# EAGLE design DRV8818 (EAGLE 7.2.0)
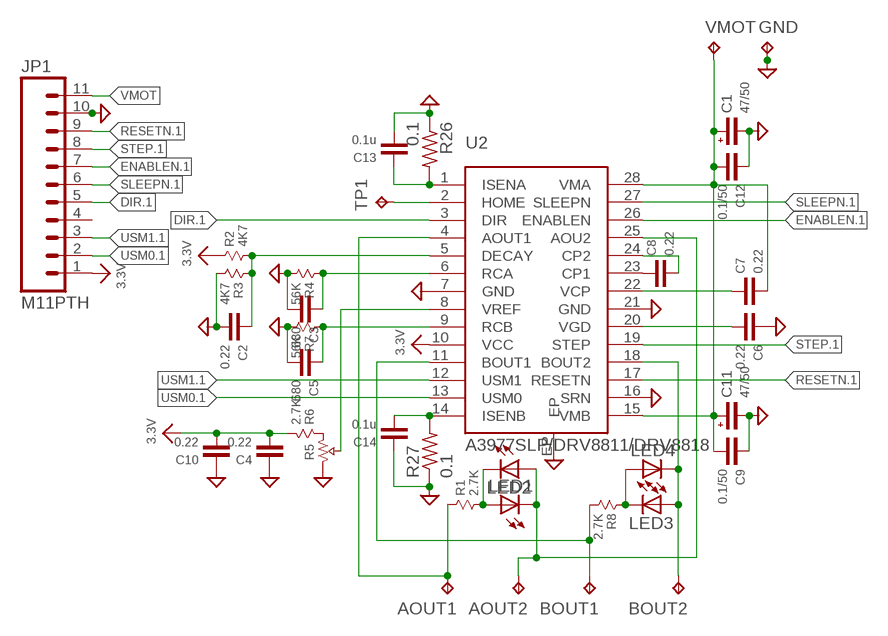
[diagram p0: schematic, sheet 1]

## Parts
AOUT1  TPTP20R  [TP20R]
AOUT2  TPTP20R  [TP20R]
BOUT1  TPTP20R  [TP20R]
BOUT2  TPTP20R  [TP20R]
C1  47/50  CAP-POL-7343  [CT7343]
C2  0.22  CAP-0603  [0603]
C3  680  CAP-0603  [0603]
C4  0.22  CAP-0603  [0603]
C5  680  CAP-0603  [0603]
C6  0.22  CAP-0603  [0603]
C7  0.22  CAP-0603  [0603]
C8  0.22  CAP-0603  [0603]
C9  0.1/50  CAP-0603  [0603]
C10  0.22  CAP-0603  [0603]
C11  47/50  CAP-POL-7343  [CT7343]
C12  0.1/50  CAP-0603  [0603]
C13  0.1u  CAP-0603  [0603]
C14  0.1u  CAP-0603  [0603]
GND  TPTP20R  [TP20R]
JP1  M11PTH  [1X11]
LED1  LEDCHIP-LED0603  [CHIP-LED0603]
LED2  LEDCHIP-LED0603  [CHIP-LED0603]
LED3  LEDCHIP-LED0603  [CHIP-LED0603]
LED4  LEDCHIP-LED0603  [CHIP-LED0603]
R1  2.7K  RESISTOR-0603  [0603]
R2  4K7  RESISTOR-0603  [0603]
R3  4K7  RESISTOR-0603  [0603]
R4  56K  RESISTOR-0603  [0603]
R5  PVZ3A  [PVZ3A]
R6  2.7K  RESISTOR-0603  [0603]
R7  56K  RESISTOR-0603  [0603]
R8  2.7K  RESISTOR-0603  [0603]
R26  0.1  R-US_R2512  [R2512]
R27  0.1  R-US_R2512  [R2512]
TP1  TPTP08R  [TP08R]
U2  A3977SLP/DRV8811/DRV8818  DRV8811  [SSOP28EP]
VMOT  TPTP20R  [TP20R]

## Nets
3.3V: C4.1 C10.1 JP1.1 R2.1 R6.2 U2.10(VCC)
AOUT1: AOUT1.TP R1.1 U2.4(AOUT1)
AOUT2: AOUT2.TP LED1.C LED2.A U2.25(AOU2)
BOUT1: BOUT1.TP R8.2 U2.11(BOUT1)
BOUT2: BOUT2.TP LED3.A LED4.C U2.18(BOUT2)
DIR.1: JP1.5 U2.3(DIR)
ENABLEN.1: JP1.7 U2.26(ENABLEN)
GND: C1.- C2.1 C3.1 C4.2 C5.1 C6.2 C9.2 C10.2 C11.- C12.2 C13.1 C14.2 GND.TP JP1.10 R3.2 R4.2 R5.1 R7.2 R26.1 R27.1 U2.7(GND) U2.16(SRN) U2.21(GND) U2.EP
N$1: C14.1 R27.2 U2.14(ISENB)
N$2: LED3.C LED4.A R8.1
N$3: LED1.A LED2.C R1.2
N$5: C2.2 R2.2 R3.1 U2.5(DECAY)
N$6: C3.2 R4.1 U2.6(RCA)
N$7: R5.3 R6.1
N$8: R5.2 U2.8(VREF)
N$9: C5.2 R7.1 U2.9(RCB)
N$12: C13.2 R26.2 U2.1(ISENA)
N$13: TP1.TP U2.2(HOME)
N$16: C7.2 U2.22(VCP)
N$17: C6.1 U2.20(VGD)
N$21: C8.2 U2.23(CP1)
N$22: C8.1 U2.24(CP2)
RESETN.1: JP1.9 U2.17(RESETN)
SLEEPN.1: JP1.6 U2.27(SLEEPN)
STEP.1: JP1.8 U2.19(STEP)
USM0.1: JP1.2 U2.13(USM0)
USM1.1: JP1.3 U2.12(USM1)
VMOT: C1.+ C7.1 C9.1 C11.+ C12.1 JP1.11 U2.15(VMB) U2.28(VMA) VMOT.TP
Unconnected: JP1.4

## Library data of the parts
AOUT1 AOUT2 BOUT1 BOUT2 GND TP1 VMOT = testpad:TP: Test pad
C1 C11 = X893:CAP-POL
C2-C10 C12-C14 = X893:CAP: Capacitor
JP1 = SparkFun:M11: Header 11 Standard 11-pin 0.1" header. Use with straight break away headers (SKU : PRT-00116), right angle break away headers (PRT-00553), swiss pins (PRT-00743), machine pins (PRT-00117), and female headers (PRT-00115).
LED1-LED4 = led:LED: LED OSRAM: - CHIPLED LG R971, LG N971, LY N971, LG Q971, LY Q971, LO R971, LY R971 LH N974, LH R974 LS Q976, LO Q976, LY Q976 LO Q996 - Hyper CHIPLED LW Q18S LB Q993, LB Q99A, LB R99A - SideLED LS A670, LO A670, LY A670, LG A670, LP A670 LB A673, LV A673, LT A673, LW A673 LH A674 LY A675 LS A676, LA A676, LO A676, LY A676, LW A676 LS A679, LY A679, LG A679 - Hyper Micro SIDELED® LS Y876, LA Y876, LO Y876, LY Y876 LT Y87S - SmartLED LW L88C, LW L88S LB L89C, LB L89S, LG L890 LS L89K, LO L89K, LY L89K LS L896, LA L896, LO L896, LY L896 - TOPLED LS T670, LO T670, LY T670, LG T670, LP T670 LSG T670, LSP T670, LSY T670, LOP T670, LYG T670 LG T671, LOG T671, LSG T671 LB T673, LV T673, LT T673, LW T673 LH T674 LS T676, LA T676, LO T676, LY T676, LB T676, LH T676, LSB T676, LW T676 LB T67C, LV T67C, LT T67C, LS T67K, LO T67K, LY T67K, LW E67C LS E67B, LA E67B, LO E67B, LY E67B, LB E67C, LV E67C, LT E67C LW T67C LS T679, LY T679, LG T679 LS T770, LO T770, LY T770, LG T770, LP T770 LB T773, LV T773, LT T773, LW T773 LH T774 LS E675, LA E675, LY E675, LS T675 LS T776, LA T776, LO T776, LY T776, LB T776 LHGB T686 LT T68C, LB T68C - Hyper Mini TOPLED® LB M676 - Mini TOPLED Santana® LG M470 LS M47K, LO M47K, LY M47K Source: http://www.osram.convergy.de LUXEON: - LUMILED® LXK2-PW12-R00, LXK2-PW12-S00, LXK2-PW14-U00, LXK2-PW14-V00 LXK2-PM12-R00, LXK2-PM12-S00, LXK2-PM14-U00 LXK2-PE12-Q00, LXK2-PE12-R00, LXK2-PE12-S00, LXK2-PE14-T00, LXK2-PE14-U00 LXK2-PB12-K00, LXK2-PB12-L00, LXK2-PB12-M00, LXK2-PB14-N00, LXK2-PB14-P00, LXK2-PB14-Q00 LXK2-PR12-L00, LXK2-PR12-M00, LXK2-PR14-Q00, LXK2-PR14-R00 LXK2-PD12-Q00, LXK2-PD12-R00, LXK2-PD12-S00 LXK2-PH12-R00, LXK2-PH12-S00 LXK2-PL12-P00, LXK2-PL12-Q00, LXK2-PL12-R00 Source: www.luxeon.com KINGBRIGHT: KA-3528ASYC Source: www.kingbright.com
R1-R4 R6-R8 = X893:RESISTOR
R5 = X893:PVZ3A: RESISTOR VARIABLE
R26 R27 = resistor:R-US_: RESISTOR, American symbol
U2 = X893:DRV8811

## Board
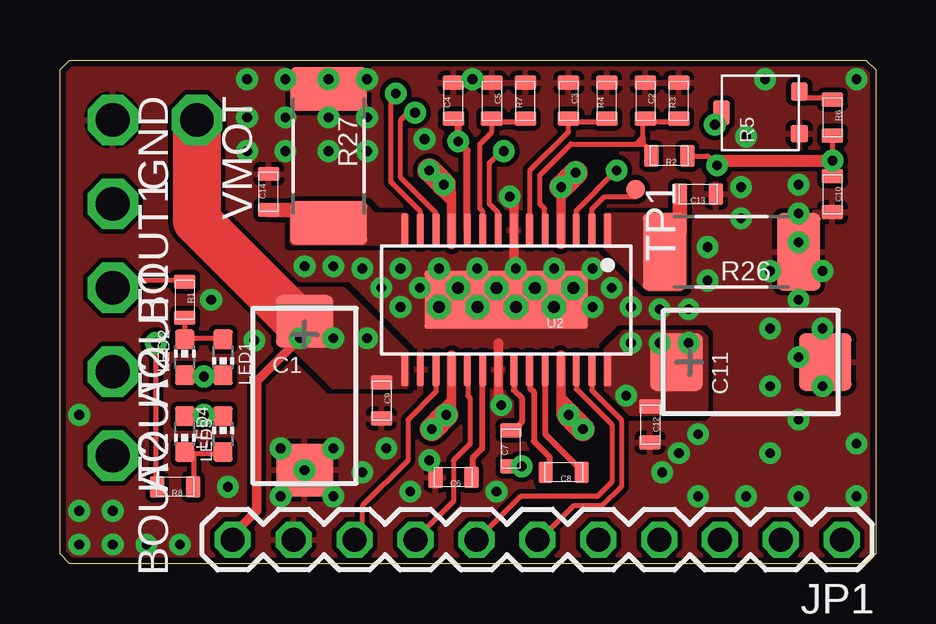
[diagram p1: board, top side]
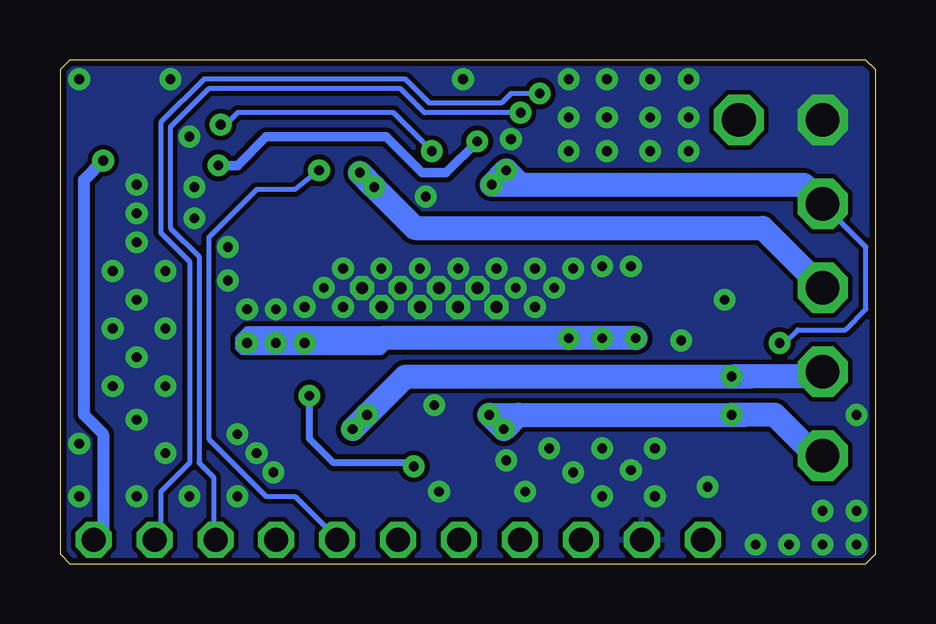
[diagram p2: board, bottom side, seen from below]

Size 34 x 21 mm. Coordinates in mm from the lower left corner, seen from the top.
Outline: 0.4,21 33.6,21 34,20.6 34,0.4 33.6,0 0.4,0 0,0.4 0,20.6 0.4,21
Copper layers (1+16): Top 0.035mm / dielectric 1.5mm / Bottom 0.035mm
Design rules "Rezonit": minimum track width 0.2mm, minimum drill 0.4mm, track to track 0.2mm, track to pad 0.2mm, pad to pad 0.2mm, via to via 0.2mm, smd to smd 0mil, copper to edge 0.25mm, drill to drill 0.4mm, minimum pad ring 0.25mm, minimum via ring 0.25mm, stop-mask expansion 4mil, vias tented up to drill 0.4mm, thermal gap 0.2mm

### Footprints (pad centres in the part's own frame; a part is rotated, then mirrored left to right if it is on the bottom)
TP20R = smd 2 x 2: TP 0,0
CT7343 = smd 2.2 x 2.4: + -3.1,0; - 3.1,0
0603 = smd 0.6 x 0.9: 1 -0.75,0; 2 0.75,0
1X11 = drill 1 pad 1.5 octagon: 1 0,0; 2 2.54,0; 3 5.08,0; 4 7.62,0; 5 10.16,0; 6 12.7,0; 7 15.24,0; 8 17.78,0; 9 20.32,0; 10 22.86,0; 11 25.4,0
CHIP-LED0603 = smd 0.8 x 0.8: A 0,-0.75; C 0,0.75
PVZ3A = smd 0.7 x 0.75: 1 -0.875,-1.625 | smd 1 x 0.7: 2 0,1.625 | smd 0.75 x 0.7: 3 0.875,-1.625
R2512 = smd 1.8 x 3.2: 1 -2.8,0; 2 2.8,0
TP08R = smd 0.8 x 0.8: TP 0,0
SSOP28EP = smd 0.3 x 1.4: 1 -4.225,-2.9; 2 -3.575,-2.9; 3 -2.925,-2.9; 4 -2.275,-2.9; 5 -1.625,-2.9; 6 -0.975,-2.9; 7 -0.325,-2.9; 8 0.325,-2.9; 9 0.975,-2.9; 10 1.625,-2.9; 11 2.275,-2.9; 12 2.925,-2.9; 13 3.575,-2.9; 14 4.225,-2.9; 15 4.225,2.9; 16 3.575,2.9; 17 2.925,2.9; 18 2.275,2.9; 19 1.625,2.9; 20 0.975,2.9; 21 0.325,2.9; 22 -0.325,2.9; 23 -0.975,2.9; 24 -1.625,2.9; 25 -2.275,2.9; 26 -2.925,2.9; 27 -3.575,2.9; 28 -4.225,2.9 | smd 6.8 x 2.4: EP 0,0

### Placement (x,y rotation side)
AOUT1  2.2,11.5 270 top
AOUT2  2.2,8 270 top
BOUT1  2.2,15 270 top
BOUT2  2.2,4.5 270 top
C1  10.2,7 270 top
C2  24.4,19.3 270 top
C3  21.2,19.3 270 top
C4  16.4,19.3 90 top
C5  18,19.3 270 top
C6  16.4,3.6 180 top
C7  18.8,4.8 90 top
C8  21,3.8 180 top
C9  13.4,6.8 270 top
C10  32.2,15.4 270 top
C11  28.8,8.4 0 top
C12  24.6,5.8 270 top
C13  26.6,15.4 180 top
C14  8.7,15.5 90 top
GND  2.2,18.5 270 top
JP1  32.6,1 180 top
LED1  6.8,8.6 180 top
LED2  5.2,8.6 0 top
LED3  5.2,5.4 180 top
LED4  6.8,5.4 0 top
R1  5.2,11 270 top
R2  25.4,17 180 top
R3  25.8,19.3 90 top
R4  22.8,19.3 90 top
R5  29.2,18.8 90 top
R6  32.2,18.6 270 top
R7  19.4,19.3 90 top
R8  4.8,3.2 180 top
R26  28,13 180 top
R27  11.2,17 270 top
TP1  24,15.6 270 top
U2  18.6,11 180 top
VMOT  5.7,18.5 270 top

### Tracks (layer width: path | path; a pad name or v marks a point on that pad's centre or on a via)
3.3V  (via drill 0.4)
  Top 0.2: R6.2 v32.2,16.8 | R2.1 27,17 v27.4,16.6
  Top 0.3: U2.10 16.98,17.23 v16.6,17.6 16.6,18.5 16.55,18.55 C4.1
  Top 0.5: v27.4,16.6 27.4,16.8 v32.2,16.8 C10.1
  Bottom 0.4: v27.4,16.6 26.6,16.6 25.4,17.8 20.4,17.8 18.9,16.3 17.9,16.3 v16.6,17.6
  Bottom 0.5: v32.2,16.8 33,16 33,6.2 32.2,5.4 32.2,1.4 JP1.1
AOUT1  (via drill 0.4, 1.4)
  Top 0.2: 20.93,15.3 20.88,15.3 | R1.1 5.2,11.8 2.5,11.8 AOUT1.TP
  Top 0.4: v20.9,15.7 20.88,15.47 20.88,15.3 U2.4 20.88,13.3 | 21.52,15.9 20.93,15.3
  Top 1: v21.5,16.3 v20.9,15.7
  Bottom 1: v21.5,16.3 v20.9,15.7 19.2,14 4.7,14 AOUT1.TP
  other vias: 2.2,11.5
AOUT2  (via drill 0.4, 1.4)
  Top 0.2: 21.7,6.12 21.7,6.2 v21.2,6.2 | LED1.C 7,7.8 v6,7.8 5.4,7.8 LED2.A
  Top 0.4: v21.2,6.2 20.88,6.2 U2.25 20.88,8.7 | 21.7,6.12 20.9,6.92
  Top 1: v21.8,5.6 v21.2,6.2
  Bottom 1: v21.8,5.6 v21.2,6.2 19.6,7.8 v6,7.8 | v6,7.8 5.2,7.8 | AOUT2.TP 2.4,7.8 v6,7.8
  other vias: 2.2,8
BOUT1  (via drill 0.4, 1.4)
  Top 0.2: R8.2 4.05,3.15 4,3.2 v4,9.2
  Top 0.4: v16,15.8 16.32,15.47 U2.11 16.32,13.3 | 16.3,15.1 15.4,16 v15.4,16.4 15.8,16.4 16.3,15.9 16.3,15.2
  Top 1: v16,15.8 v15.4,16.4
  Bottom 0.2: v4,9.2 3.8,9.2 3.25,9.75 1.25,9.75 0.4,10.6 0.4,13.2 BOUT1.TP
  Bottom 1: 14.8,15.8 v16,15.8 v15.4,16.4 14.8,15.8 | BOUT1.TP 3,15.8 14.8,15.8
  other vias: 2.2,15
BOUT2  (via drill 0.4, 1.4)
  Top 0.2: LED4.C 7,6.2 v6,6.2 5.4,6.2 LED3.A
  Top 0.4: v16.1,6.2 16.32,6.53 U2.18 16.32,8.7 | v15.5,5.6 15.5,6 16.3,6.8
  Top 1: v16.1,6.2 v15.5,5.6
  Bottom 1: 14.9,6.2 v16.1,6.2 v15.5,5.6 14.9,6.2 | 14.9,6.2 v6,6.2 | v6,6.2 5.4,6.2 | BOUT2.TP 2.3,4.6 2.6,4.6 4.2,6.2 v6,6.2
  other vias: 2.2,4.5
DIR.1  (via drill 0.4)
  Top 0.2: U2.3 21.52,14.72 v23.2,16.4
  Bottom 0.2: v23.2,16.4 24.2,15.6 25.8,15.6 27.8,13.6 27.8,5.2 25.4,2.8 24.2,2.8 22.8,1.4 22.8,1.36 JP1.5
ENABLEN.1
  Top 0.2: U2.26 21.52,7.28 23,5.8 23,3.4 22.4,2.8 19.2,2.8 17.8,1.4 17.76,1.4 JP1.7
GND  (via drill 0.4, 0.5, 1.4)
  Top 0.4: 18.93,15 18.93,12.8 | 18.27,9.2 18.27,7
  other vias: 2.2,18.5 18.4,6.6 18.75,15.3 18.2,11.5 19.8,11.5 16.6,11.5 15,11.5 21.4,11.5 17.4,12.3 17.4,10.7 19,10.7 19,12.3 15.8,10.7 15.8,12.3 13.4,11.5 14.2,10.7 20.6,12.3 20.6,10.7 22.2,12.3 22.2,10.7 25.1,3.8 14.2,12.3 11.4,4.8 2.2,2.2 9.2,4.8 12.8,17.2 11.2,17.2 9.4,17.2 9.4,20.2 11.2,20.2 12.8,20.2 8.1,9.3 6.3,11 12.8,18.6 11.2,18.6 9.4,18.6 28.4,14.4 27,11.8 30.8,2.8 30.8,11 31.8,9.8 30.8,8.6 29.6,9.8 31.8,7.4 29.6,7.4 30.8,13.4 30.8,6 31.8,12.2 29.6,4.6 25,10.6 15.2,17.7 28.6,17.8 28.4,15.7 2.2,0.8 14.6,3 3.6,0.8 9.2,2.8 10.2,3.9 13.6,4.8 33.2,20.2 5,0.8 0.8,2.2 0.8,6.2 18.2,3 27,13.2 26.6,5.4 29.6,12.2 30.8,15.8 30.8,14.6 26.6,2.8 28.6,2.8 33.2,5 33.2,2.8 0.8,0.8 17.2,20.2 29.4,20.2 12.6,12.3 23,11.5 23.8,10.7 12.6,3.8 15.4,4.3 11.4,2.8 26.2,10.6 7,3.2 11.4,12.4 10.2,12.4 7.8,20.2 7.8,18.6 7.8,17.2 25.8,4.6
  pour Top (rank 2): 0,21 0,0 34,0 34,21
  pour Bottom: 0,21 0,0 34,0 34,21
N$1
  Top 0.6: C14.1 10.45,14.75
  pour Top (no thermals): 14.4,14.5 13.1,14.5 12.7,14.9 9.7,14.9 9.7,13.4 14.4,13.4
N$2
  Top 0.2: LED3.C 5.4,4.6 5.6,4.6 | 5.6,4.6 7,4.6 LED4.A | R8.1 5.6,3.2 5.6,4.6
N$3
  Top 0.2: 5.2,9.4 6.8,9.4 LED1.A | R1.2 5.2,9.4 | 5.2,9.4 LED2.C
N$5
  Top 0.2: U2.5 20.23,14.38 20.2,14.4 20.2,14.8 20,15 20,16.2 21.3,17.5 24,17.5 | 24,17.5 24.3,17.5 | 24.3,17.8 24.3,18.5 C2.2 24.45,18.4 25.8,18.4 | 25.8,18.4 R3.1 25.85,18.4 25.8,18.4 | R2.2 24.6,17 24.6,17.3 24.3,17.5 | 24.3,17.8 24,17.5 | 24.3,17.8 24.3,17.5
N$6
  Top 0.2: U2.6 19.57,13.97 19.6,14 19.6,16.4 21.2,18 C3.2 21.25,18.4 22.8,18.4 R4.1
N$7
  Top 0.2: R6.1 32.2,19.4 30.9,19.4 R5.3
N$8  (via drill 0.4)
  Top 0.2: U2.8 18.27,14.62 17.9,15 17.9,16.7 18.4,17.2 v18.5,17.2 | R5.2 27.57,18.82 27.4,18.6 27.4,18.5 27.3,18.4 v27.3,18.3
  Bottom 0.2: v18.5,17.2 20.1,18.8 26.6,18.8 27.1,18.3 v27.3,18.3
N$9
  Top 0.2: U2.9 17.62,14.68 17.5,14.8 17.5,17.5 18,18 18,18.4 | R7.1 19.4,18.4 18.05,18.4 | 18,18.4 18.05,18.4 | 18.05,18.4 C5.2 18,18.4
N$12
  Top 0.6: C13.2 25.85,13.85
  pour Top (no thermals): 22.8,14.5 22.8,13.2 24.5,11.5 25.9,11.5 26,11.6 26,14.5
N$13
  Top 0.2: U2.2 22.18,14.78 22.7,15.3 24,15.3 TP1.TP
N$16
  Top 0.25: U2.22 18.93,7.22 19.25,6.9 19.25,5.9 18.9,5.55 C7.2
N$17
  Top 0.25: U2.20 17.62,7.83 17.6,7.8 17.6,4.8 17.2,4.4 17.2,3.65 C6.1
N$21
  Top 0.25: U2.23 19.57,7.6 19.6,7.58 19.6,7.3 19.75,7.15 19.75,5.1 20.4,4.45 20.4,3.8 C8.2
N$22
  Top 0.25: U2.24 20.23,5.4 21.57,4.05 21.57,3.98 C8.1
RESETN.1
  Top 0.2: U2.17 15.68,7.17 14.5,6 14.5,4.3 12.6,2.4 12.6,1.2 JP1.9
SLEEPN.1
  Top 0.2: U2.27 22.18,7.22 23.4,6 23.4,3.2 22.6,2.4 21.4,2.4 20.4,1.4 20.3,1.4 JP1.6
STEP.1
  Top 0.2: U2.19 17,8.07 17,7 17.1,6.9 17.1,5 16.4,4.3 16.4,2.6 15.2,1.4 15.2,1.38 JP1.8
USM0.1  (via drill 0.4)
  Top 0.2: U2.13 15.03,14.68 13.8,15.9 13.8,19.4 v14,19.6
  Bottom 0.2: v14,19.6 15.2,19.6 15.6,19.2 18.6,19.2 19.6,20.2 28,20.2 29.8,18.4 29.8,13.8 28.6,12.6 28.6,4.2 29.8,3 29.8,1.26 JP1.2
USM1.1  (via drill 0.4)
  Top 0.2: U2.12 15.68,14.62 14.2,16.1 14.2,18.5 14.5,18.8 v14.8,18.8
  Bottom 0.2: v14.8,18.8 18.8,18.8 19.8,19.8 27.8,19.8 29.4,18.2 29.4,14 28.2,12.8 28.2,4.2 27.6,3.6 27.6,1.08 JP1.3
VMOT  (via drill 0.4, 1.4)
  Top 0.25: C7.1 v19.25,4.05
  Top 0.4: JP1.11 7.2,1.2 8.2,2.2 8.2,7.6 v10,9.4
  Top 2: 9.8,10.2 5.7,14.3 VMOT.TP
  Bottom 0.2: v23.8,9.2 23.8,8.8 | 23.8,8.8 20.6,8.8 20.2,9.2 | 20.4,9.8 26.2,9.8 26.6,9.4 26.6,9 26.4,8.8 23.8,8.8
  Bottom 0.3: v19.25,4.05 19.4,4.05 19.55,4.2 22.6,4.2 23.6,5.2 v23.6,7
  Bottom 1: v10,9.4 v11.4,9.4 v12.8,9.4 20.6,9.4 20.8,9.2 v23.8,9.2 v25,9.2 v26.2,9.2
  other vias: 5.7,18.5
  pour Top (no thermals): 22.8,8.9 22.8,7.3 23.8,6.3 26.7,6.3 26.9,6.5 26.9,9.4 26.7,9.6 23.5,9.6
  pour Top (no thermals): 14.4,8.8 14.4,7.4 11.4,7.4 9.3,9.5 9.3,11.4 11.8,11.4

### Text on the board
Reference: GND | VMOT | BOUT1 | AOUT1 | AOUT2 | BOUT2 | VMOTOR | GND | RESETN | STEP | ENABLEN | SLEEPN | DIR | USM1 | USM0 | +3.3V